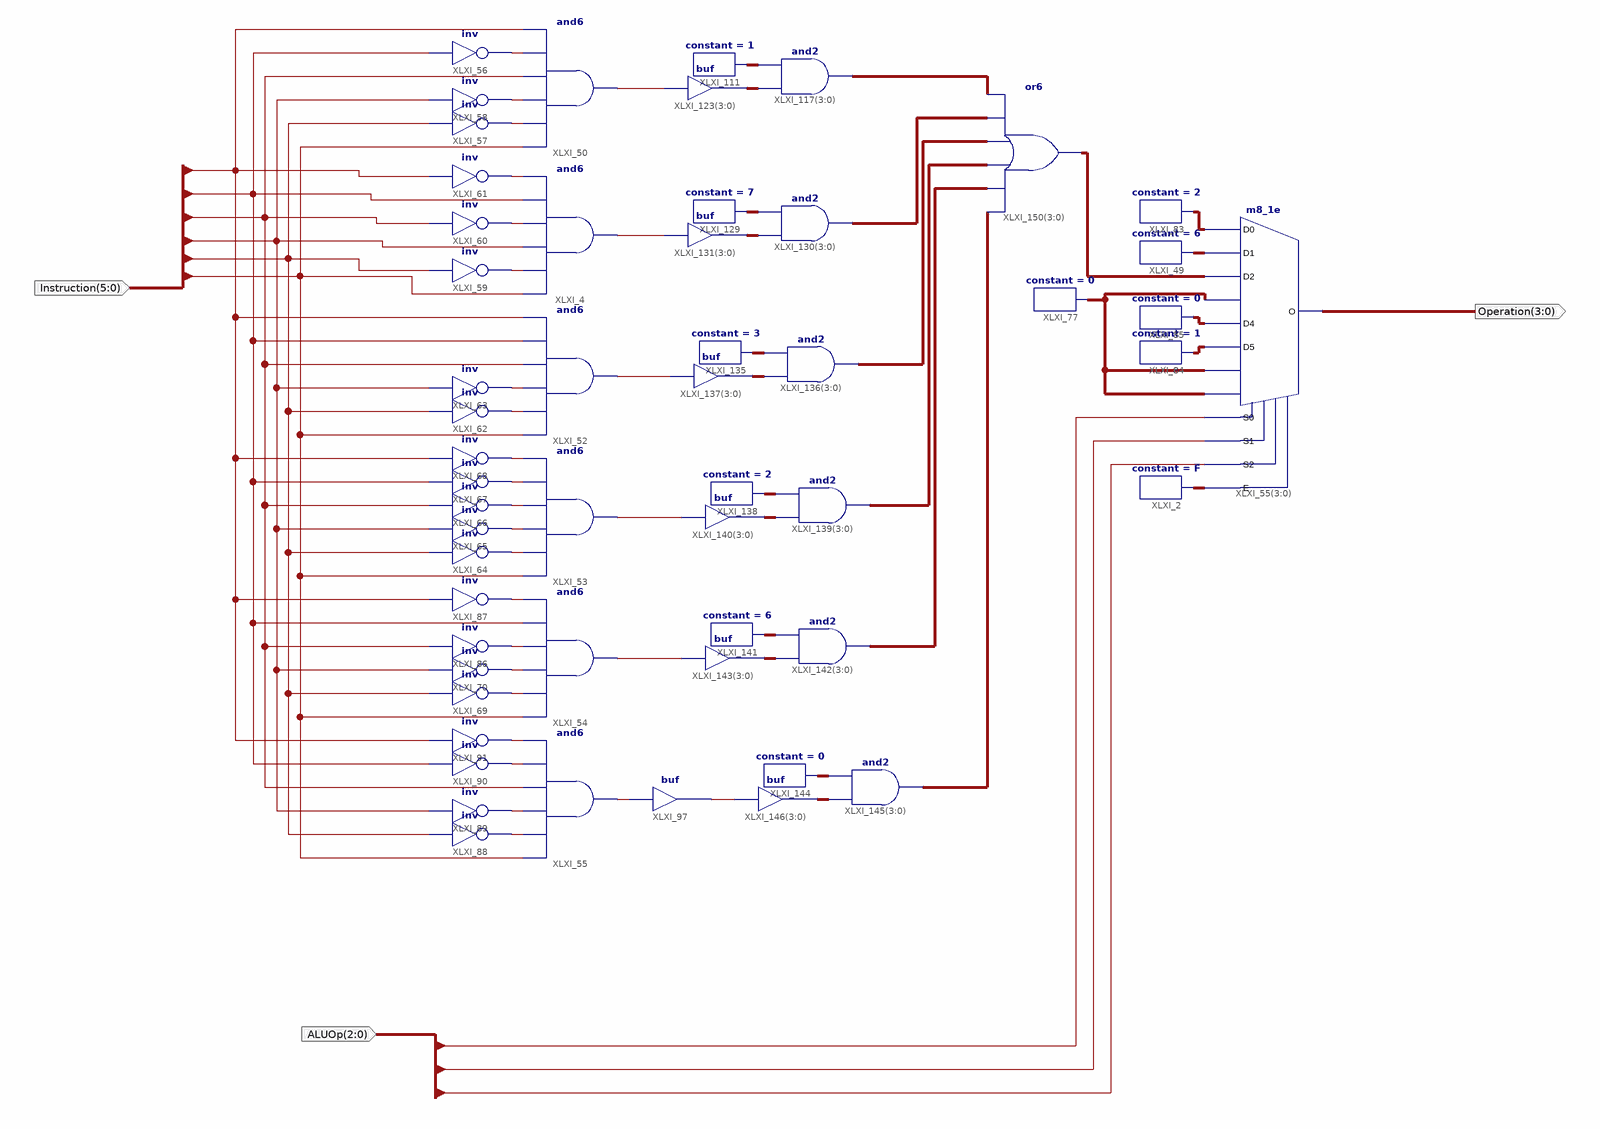
[diagram p0: schematic sheet 1]
// Xilinx ISE schematic ALU_control.sch (spartan3) as structural Verilog: 54 symbols, 3 ports
module ALU_control (
  input  [5:0] Instruction,
  input  [2:0] ALUOp,
  output [3:0] Operation
);

  wire XLXN_59, XLXN_60, XLXN_61, XLXN_62, XLXN_63, XLXN_64, XLXN_65, XLXN_66, XLXN_67, XLXN_68, XLXN_69,
       XLXN_70, XLXN_71, XLXN_72, XLXN_73, XLXN_74, XLXN_75, XLXN_76, XLXN_77, XLXN_78, XLXN_79, XLXN_110,
       XLXN_114, XLXN_119, XLXN_151, XLXN_178, XLXN_191, XLXN_192;
  wire [3:0] XLXN_13, XLXN_14, XLXN_16, XLXN_50, XLXN_52, XLXN_53, XLXN_116, XLXN_165, XLXN_173, XLXN_176,
       XLXN_177, XLXN_181, XLXN_182, XLXN_183, XLXN_184, XLXN_185, XLXN_186, XLXN_187, XLXN_188, XLXN_193,
       XLXN_194, XLXN_195, XLXN_196, XLXN_197, XLXN_198;

  m8_1e XLXI_55[3:0] (
    .D0(XLXN_52), .D1(XLXN_53), .D2(XLXN_116), .D3(XLXN_16), .D4(XLXN_13), .D5(XLXN_14), .D6(XLXN_16),
    .D7(XLXN_16), .E(XLXN_50), .S0(ALUOp[0]), .S1(ALUOp[1]), .S2(ALUOp[2]), .O(Operation));
  constant #(.CValue("F")) XLXI_2 (.O(XLXN_50));
  constant #(.CValue("6")) XLXI_49 (.O(XLXN_53));
  and XLXI_4 (XLXN_178, Instruction[5], XLXN_62, Instruction[3], XLXN_63, Instruction[1], XLXN_64);
  and XLXI_52 (XLXN_119, Instruction[5], XLXN_65, XLXN_66, Instruction[2], Instruction[1], Instruction[0]);
  and XLXI_53 (XLXN_151, Instruction[5], XLXN_67, XLXN_68, XLXN_69, XLXN_70, XLXN_71);
  and XLXI_54 (XLXN_110, Instruction[5], XLXN_72, XLXN_73, XLXN_74, Instruction[1], XLXN_75);
  and XLXI_55_dup2 (XLXN_114, Instruction[5], XLXN_76, XLXN_77, Instruction[2], XLXN_78, XLXN_79);
  not XLXI_56 (XLXN_59, Instruction[1]);
  not XLXI_57 (XLXN_60, Instruction[4]);
  not XLXI_58 (XLXN_61, Instruction[3]);
  not XLXI_59 (XLXN_62, Instruction[4]);
  not XLXI_60 (XLXN_63, Instruction[2]);
  not XLXI_61 (XLXN_64, Instruction[0]);
  not XLXI_62 (XLXN_65, Instruction[4]);
  not XLXI_63 (XLXN_66, Instruction[3]);
  not XLXI_64 (XLXN_67, Instruction[4]);
  not XLXI_65 (XLXN_68, Instruction[3]);
  not XLXI_66 (XLXN_69, Instruction[2]);
  not XLXI_67 (XLXN_70, Instruction[1]);
  not XLXI_68 (XLXN_71, Instruction[0]);
  not XLXI_69 (XLXN_72, Instruction[4]);
  not XLXI_70 (XLXN_73, Instruction[3]);
  not XLXI_86 (XLXN_74, Instruction[2]);
  not XLXI_87 (XLXN_75, Instruction[0]);
  not XLXI_88 (XLXN_76, Instruction[4]);
  not XLXI_89 (XLXN_77, Instruction[3]);
  not XLXI_90 (XLXN_78, Instruction[1]);
  not XLXI_91 (XLXN_79, Instruction[0]);
  constant #(.CValue("0")) XLXI_77 (.O(XLXN_16));
  buf XLXI_97 (XLXN_192, XLXN_114);
  constant #(.CValue("2")) XLXI_83 (.O(XLXN_52));
  constant #(.CValue("1")) XLXI_84 (.O(XLXN_14));
  constant #(.CValue("0")) XLXI_85 (.O(XLXN_13));
  and XLXI_50 (XLXN_191, Instruction[5], XLXN_60, XLXN_61, Instruction[2], XLXN_59, Instruction[0]);
  constant #(.CValue("7")) XLXI_129 (.O(XLXN_176));
  assign XLXN_194 = XLXN_177 & XLXN_176;  // and2 XLXI_130[3..0], 4 bits wide
  assign XLXN_177 = {4{XLXN_178}};  // buf XLXI_131[3..0], 4 bits wide
  constant #(.CValue("3")) XLXI_135 (.O(XLXN_181));
  assign XLXN_195 = XLXN_182 & XLXN_181;  // and2 XLXI_136[3..0], 4 bits wide
  assign XLXN_182 = {4{XLXN_119}};  // buf XLXI_137[3..0], 4 bits wide
  constant #(.CValue("2")) XLXI_138 (.O(XLXN_183));
  assign XLXN_196 = XLXN_184 & XLXN_183;  // and2 XLXI_139[3..0], 4 bits wide
  assign XLXN_184 = {4{XLXN_151}};  // buf XLXI_140[3..0], 4 bits wide
  constant #(.CValue("6")) XLXI_141 (.O(XLXN_185));
  assign XLXN_197 = XLXN_186 & XLXN_185;  // and2 XLXI_142[3..0], 4 bits wide
  assign XLXN_186 = {4{XLXN_110}};  // buf XLXI_143[3..0], 4 bits wide
  constant #(.CValue("0")) XLXI_144 (.O(XLXN_187));
  assign XLXN_198 = XLXN_188 & XLXN_187;  // and2 XLXI_145[3..0], 4 bits wide
  assign XLXN_188 = {4{XLXN_192}};  // buf XLXI_146[3..0], 4 bits wide
  constant #(.CValue("1")) XLXI_111 (.O(XLXN_165));
  assign XLXN_193 = XLXN_173 & XLXN_165;  // and2 XLXI_117[3..0], 4 bits wide
  assign XLXN_173 = {4{XLXN_191}};  // buf XLXI_123[3..0], 4 bits wide
  assign XLXN_116 = XLXN_198 | XLXN_197 | XLXN_196 | XLXN_195 | XLXN_194 | XLXN_193;  // or6 XLXI_150[3..0], 4 bits wide
endmodule
